# Altium schematic sheet MACH2.SchDoc
size A4
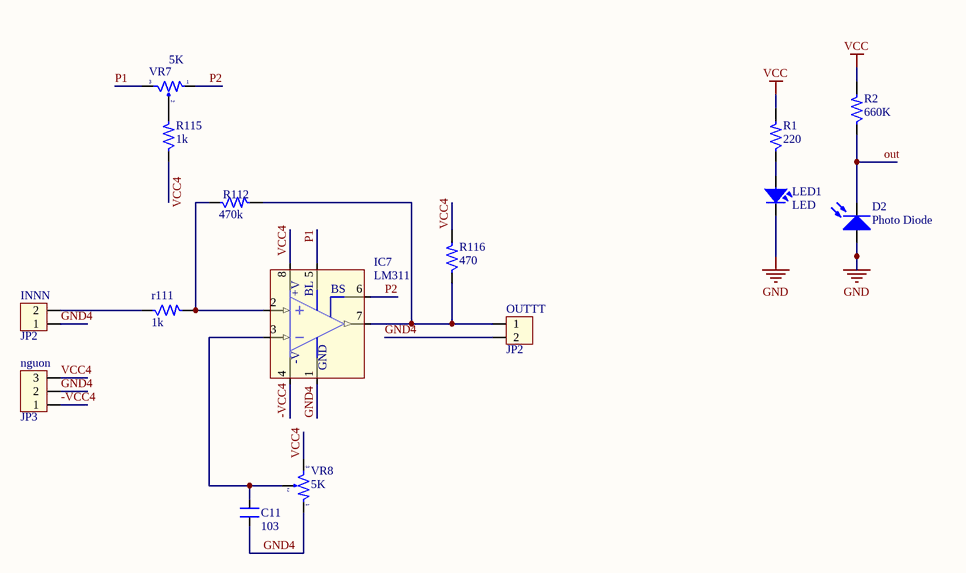
[diagram p0: MACH2.SchDoc]

## Parts
C11  103  [SM-0805]
D2  Photo Diode  [LED-5 GRe]
IC7  LM311  [DIP8/W0.3]
INNN  JP2  [CON2]
LED1  LED  [LED-3]
nguon  JP3  [CON3]
OUTTT  JP2  [CON2]
R1  220  [SM-1206]
R2  660K  [SM-1206]
r111  1k  [SM-1206]
R112  470k  [SM-1206]
R115  1k  [SM-1206]
R116  470  [SM-1206]
VR7  5K  [VR]
VR8  5K  [VR]

## Nets
GND: D2.1(A) LED1.2
VCC: R1.2 R2.2
-VCC4: IC7.4(GND) nguon.1
GND4: C11.1 IC7.1(F2) INNN.1 nguon.2 OUTTT.2 VR8.1
out: D2.2(K) R2.1
P1: IC7.5(F1) VR7.3
P2: IC7.6(F2) VR7.1
VCC4: IC7.8(V+) nguon.3 R115.1 R116.2 VR8.3
NetC11_2: C11.2 IC7.3(IN-) VR8.2
NetIC7_2: IC7.2(IN+) r111.2 R112.1
NetIC7_7: IC7.7(OUT) OUTTT.1 R112.2 R116.1
NetINNN_2: INNN.2 r111.1
NetLED1_1: LED1.1 R1.1
NetR115_2: R115.2 VR7.2

## Notes on the sheet
- (in symbol LM311) +V; BL; BS; -V

## Library data of the parts
C11 = CM: Cap SMD; Value: 103
D2 = Photo Diode: Photosensitive Diode
IC7 = LM311: Voltage Comparator; Value: DIP 8; Value: LM311
INNN OUTTT = Con2: Connector 2; Value: Connector 2
LED1 = LED: LED Single colour Green and Red; Value: LED 3 ly Single Colour; Description: LED 5 ly Single Colour; Description: Led  Vuong
nguon = Con3: Connector 3; Value: Connector 3
R1 R2 r111 R112 R115 R116 = R: Resistor 1/4W; Value: R1/4W - 1K
VR7 VR8 = VOL-S: Var Resistor; Value: Volume 50k